# Altium schematic sheet PX_Header.SchDoc
size 199 x 149 mm
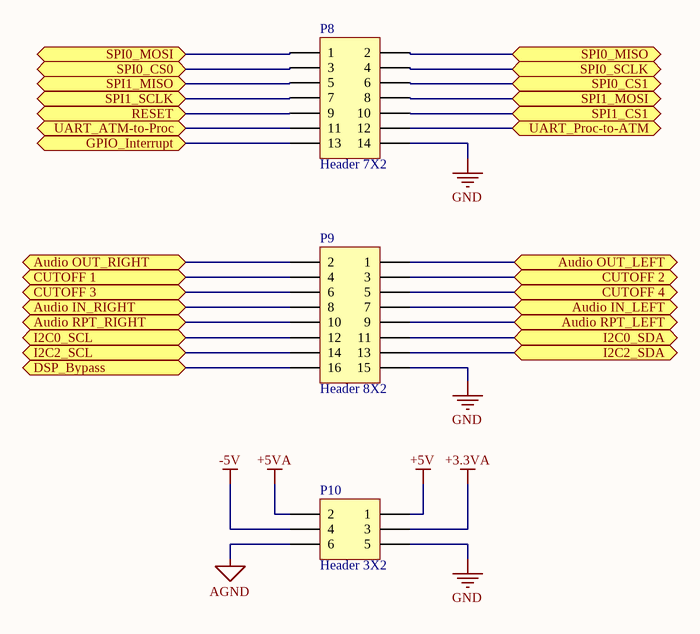
[diagram p0: PX_Header.SchDoc]

## Parts
P8  Header 7X2  [Header 14 pins]
P9  Header 8X2  [Header 16 pins]
P10  Header 3X2  [CONN_1241050-3_T]

## Ports
Audio IN_LEFT, Audio IN_RIGHT, Audio OUT_LEFT, Audio OUT_RIGHT, Audio RPT_LEFT, Audio RPT_RIGHT, CUTOFF 1, CUTOFF 2, CUTOFF 3, CUTOFF 4, DSP_Bypass, GPIO_Interrupt, I2C0_SCL, I2C0_SDA, I2C2_SCL, I2C2_SDA, RESET, SPI0_CS0, SPI0_CS1, SPI0_MISO, SPI0_MOSI, SPI0_SCLK, SPI1_CS1, SPI1_MISO, SPI1_MOSI, SPI1_SCLK, UART_ATM-to-Proc, UART_Proc-to-ATM

## Nets
+3.3VA: P10.3
+5V: P10.1
+5VA: P10.2
-5V: P10.4
AGND: P10.6
GND: P8.14 P9.15 P10.5
Audio IN_LEFT: P9.7 ; port Audio IN_LEFT
Audio IN_RIGHT: P9.8 ; port Audio IN_RIGHT
Audio OUT_LEFT: P9.1 ; port Audio OUT_LEFT
Audio OUT_RIGHT: P9.2 ; port Audio OUT_RIGHT
Audio RPT_LEFT: P9.9 ; port Audio RPT_LEFT
Audio RPT_RIGHT: P9.10 ; port Audio RPT_RIGHT
CUTOFF 1: P9.4 ; port CUTOFF 1
CUTOFF 2: P9.3 ; port CUTOFF 2
CUTOFF 3: P9.6 ; port CUTOFF 3
CUTOFF 4: P9.5 ; port CUTOFF 4
DSP_Bypass: P9.16 ; port DSP_Bypass
GPIO_Interrupt: P8.13 ; port GPIO_Interrupt
I2C0_SCL: P9.12 ; port I2C0_SCL
I2C0_SDA: P9.11 ; port I2C0_SDA
I2C2_SCL: P9.14 ; port I2C2_SCL
I2C2_SDA: P9.13 ; port I2C2_SDA
RESET: P8.9 ; port RESET
SPI0_CS0: P8.3 ; port SPI0_CS0
SPI0_CS1: P8.6 ; port SPI0_CS1
SPI0_MISO: P8.2 ; port SPI0_MISO
SPI0_MOSI: P8.1 ; port SPI0_MOSI
SPI0_SCLK: P8.4 ; port SPI0_SCLK
SPI1_CS1: P8.10 ; port SPI1_CS1
SPI1_MISO: P8.5 ; port SPI1_MISO
SPI1_MOSI: P8.8 ; port SPI1_MOSI
SPI1_SCLK: P8.7 ; port SPI1_SCLK
UART_ATM-to-Proc: P8.11 ; port UART_ATM-to-Proc
UART_Proc-to-ATM: P8.12 ; port UART_Proc-to-ATM

## Library data of the parts
P8 = Header 7X2: Header, 7-Pin, Dual row; Fournisseur: Farnell; RefFournisseur: 2724846; RefFabricant: A3A-14PA-2SV(71); Fabricant: HIROSE(HRS); DataSheet: http://www.farnell.com/cad/2239010.pdf
P9 = Header 8X2: Header, 8-Pin, Dual row; Fabricant: HIROSE(HRS); Fournisseur: Farnell; RefFabricant: A3-16PA-2SV(71); RefFournisseur: 2724833; DataSheet: http://www.farnell.com/cad/2238997.pdf
P10 = Header 3X2: Header, 3-Pin, Dual row; Fabricant: SAMTEC; Fournisseur: Farnell; RefFabricant: TSM-103-01-S-DV; RefFournisseur: 2667442; DataSheet: http://www.farnell.com/datasheets/318453.pdf